# EAGLE schematic Tello_Power_PCB (EAGLE 9.6.2)

## Sheet 1 of 6
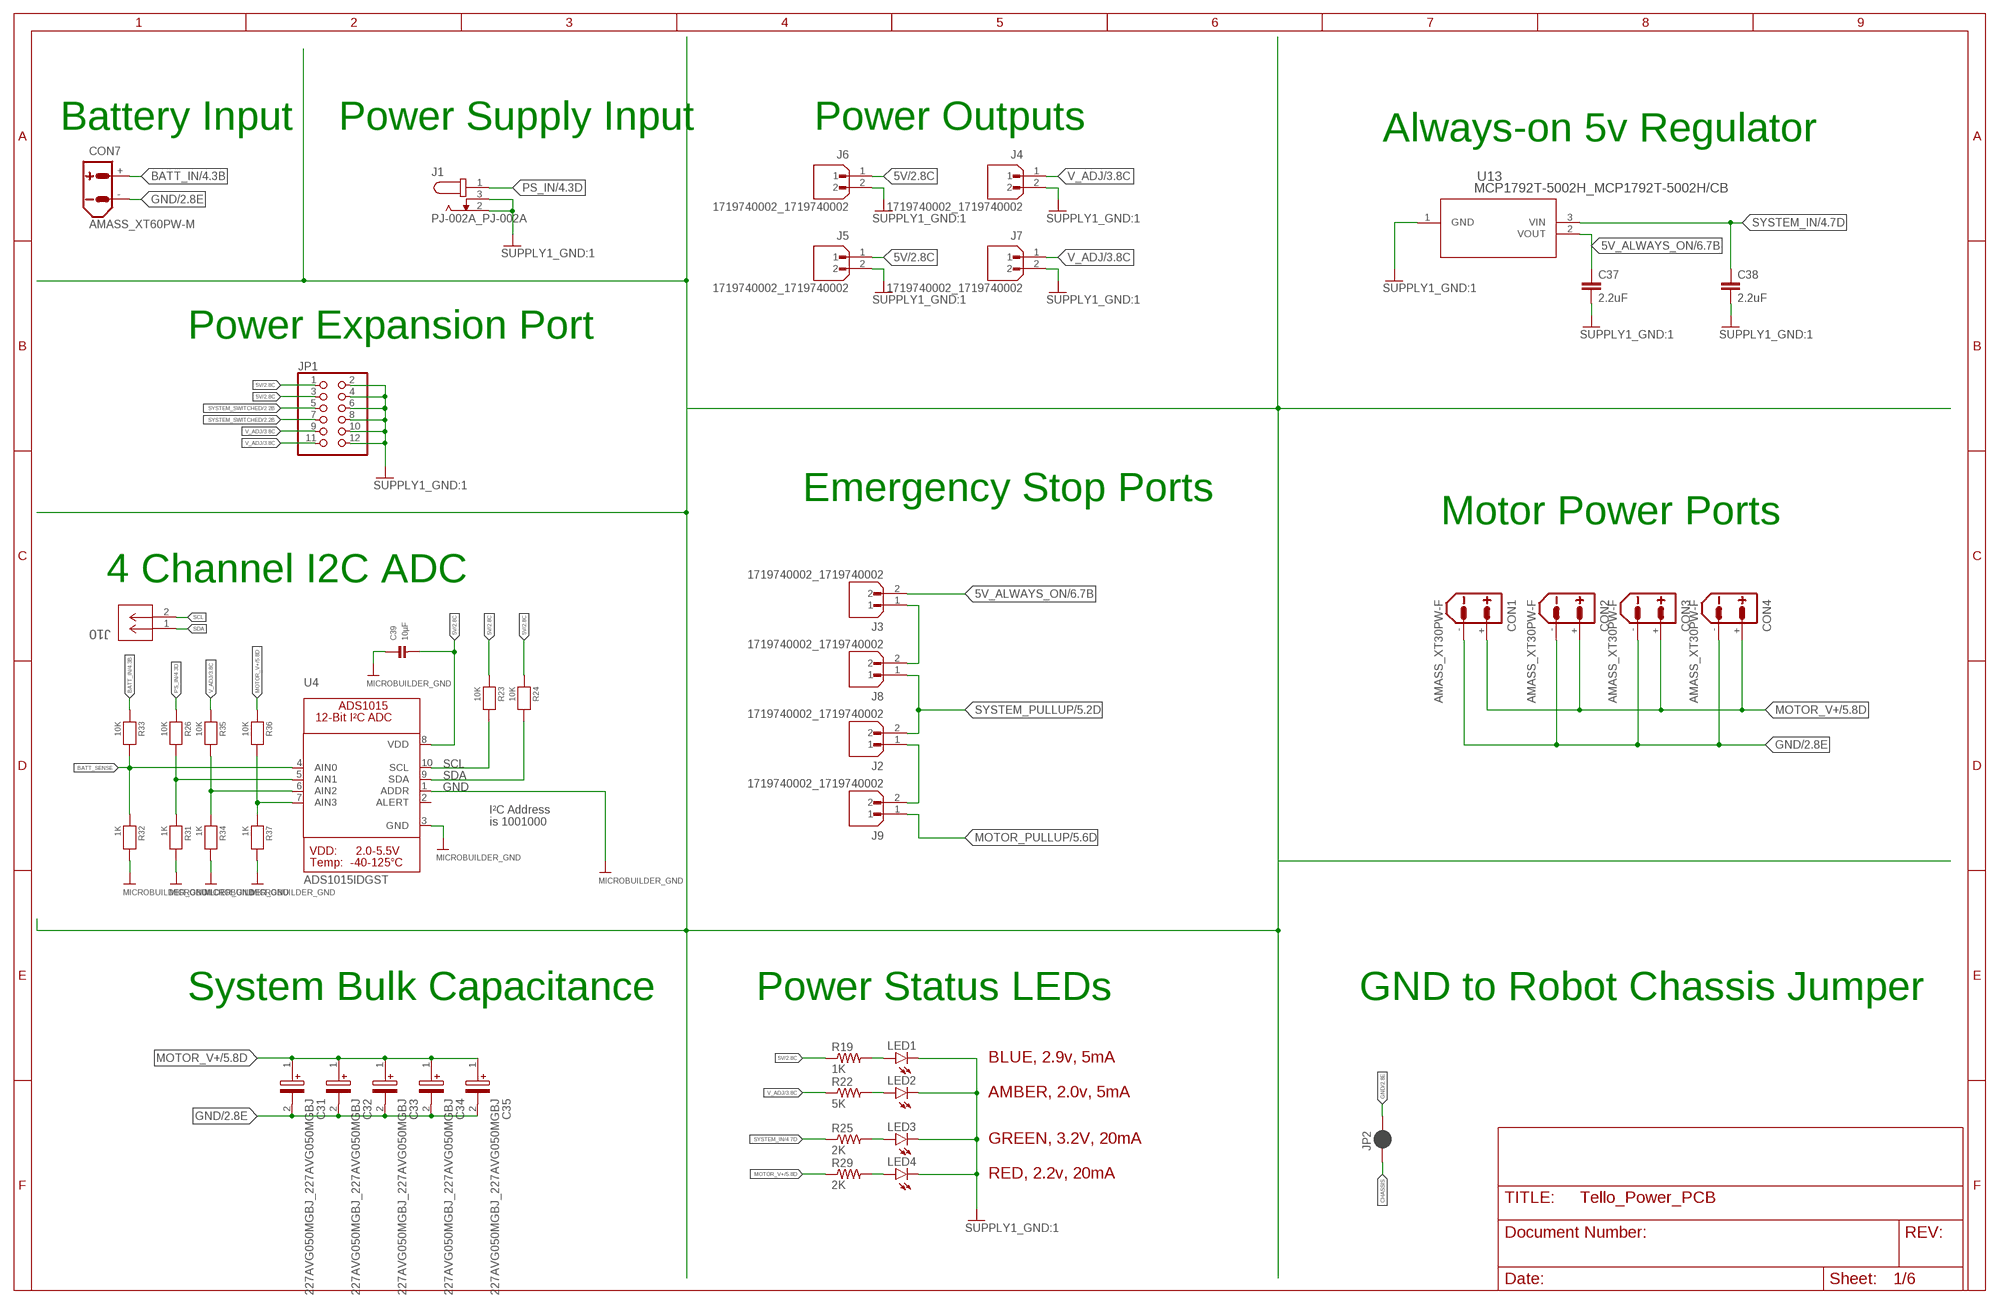
[diagram p0: schematic, sheet 1]

### Parts
C31  227AVG050MGBJ_227AVG050MGBJ  [227AVG050MGBJ_CAPPRD500W60D1025H1350]
C32  227AVG050MGBJ_227AVG050MGBJ  [227AVG050MGBJ_CAPPRD500W60D1025H1350]
C33  227AVG050MGBJ_227AVG050MGBJ  [227AVG050MGBJ_CAPPRD500W60D1025H1350]
C34  227AVG050MGBJ_227AVG050MGBJ  [227AVG050MGBJ_CAPPRD500W60D1025H1350]
C35  227AVG050MGBJ_227AVG050MGBJ  [227AVG050MGBJ_CAPPRD500W60D1025H1350]
C37  2.2uF  RCL_C-EUC0603  [RCL_C0603]
C38  2.2uF  RCL_C-EUC1206  [RCL_C1206]
C39  10µF  MICROBUILDER_CAP_CERAMIC0603  [MICROBUILDER_0603:1]
CON1  AMASS_XT30PW-F  [AMASS_XT30PW-F]
CON2  AMASS_XT30PW-F  [AMASS_XT30PW-F]
CON3  AMASS_XT30PW-F  [AMASS_XT30PW-F]
CON4  AMASS_XT30PW-F  [AMASS_XT30PW-F]
CON7  AMASS_XT60PW-M  [AMASS_XT60PW-M]
J1  PJ-002A_PJ-002A  [PJ-002A_CUI_PJ-002A]
J2  1719740002_1719740002  [1719740002_MOLEX_1719740002]
J3  1719740002_1719740002  [1719740002_MOLEX_1719740002]
J4  1719740002_1719740002  [1719740002_MOLEX_1719740002]
J5  1719740002_1719740002  [1719740002_MOLEX_1719740002]
J6  1719740002_1719740002  [1719740002_MOLEX_1719740002]
J7  1719740002_1719740002  [1719740002_MOLEX_1719740002]
J8  1719740002_1719740002  [1719740002_MOLEX_1719740002]
J9  1719740002_1719740002  [1719740002_MOLEX_1719740002]
J10  SM02B-GHS-TB_SM02BGHSTBLFSN  [SM02B-GHS-TB_CONN_SM02BGHSTB_JST]
JP1  PINHEAD_PINHD-2X6  [PINHEAD_2X06]
JP2  SPARKFUN-JUMPERS_JUMPER-SMT_2_NC_PASTE_NO-SILK  [SPARKFUN-JUMPERS_SMT-JUMPER_2_NC_PASTE_NO-SILK]
LED1  LED_LEDCHIP-LED0603  [LED_CHIP-LED0603]
LED2  LED_LEDCHIP-LED0603  [LED_CHIP-LED0603]
LED3  LED_LEDCHIP-LED0603  [LED_CHIP-LED0603]
LED4  LED_LEDCHIP-LED0603  [LED_CHIP-LED0603]
R19  1K  RCL_R-US_R0603  [RCL_R0603]
R22  5K  RCL_R-US_R0603  [RCL_R0603]
R23  10K  MICROBUILDER_RESISTOR0603  [MICROBUILDER_0603:1]
R24  10K  MICROBUILDER_RESISTOR0603  [MICROBUILDER_0603:1]
R25  2K  RCL_R-US_R0603  [RCL_R0603]
R26  10K  MICROBUILDER_RESISTOR0603  [MICROBUILDER_0603:1]
R29  2K  RCL_R-US_R0603  [RCL_R0603]
R31  1K  MICROBUILDER_RESISTOR0603  [MICROBUILDER_0603:1]
R32  1K  MICROBUILDER_RESISTOR0603  [MICROBUILDER_0603:1]
R33  10K  MICROBUILDER_RESISTOR0603  [MICROBUILDER_0603:1]
R34  1K  MICROBUILDER_RESISTOR0603  [MICROBUILDER_0603:1]
R35  10K  MICROBUILDER_RESISTOR0603  [MICROBUILDER_0603:1]
R36  10K  MICROBUILDER_RESISTOR0603  [MICROBUILDER_0603:1]
R37  1K  MICROBUILDER_RESISTOR0603  [MICROBUILDER_0603:1]
U4  ADS1015IDGST  MICROBUILDER_ADC_ADS1015  [MICROBUILDER_MSOP10]
U13  MCP1792T-5002H_MCP1792T-5002H/CB  [MCP1792T-5002H_SOT-23A_CB_MCH]

### Nets
5V: C39.2 J5.1 J6.1 JP1.1 JP1.3 R19.1 R23.1 R24.1 U4.8(VDD) ; also sheet 2
5V_ALWAYS_ON: C37.1 J3.2 U13.2(VOUT) ; also sheet 6
BATT_IN: CON7.+ R33.1 ; also sheet 4,5,6
BATT_SENSE: R32.1 R33.2 U4.4(AIN0)
CHASSIS: JP2.1
GND: C31.2(-) C32.2(-) C33.2(-) C34.2(-) C35.2(-) C37.2 C38.2 C39.1 CON1.- CON2.- CON3.- CON4.- CON7.- J1.2 J1.3 J4.2 J5.2 J6.2 J7.2 JP1.2 JP1.4 JP1.6 JP1.8 JP1.10 JP1.12 JP2.2 LED1.C LED2.C LED3.C LED4.C R31.2 R32.2 R34.2 R37.2 U4.1(ADDR) U4.3(GND) U13.1(GND) ; supply symbol labelled SUPPLY1_GND:1, MICROBUILDER_GND ; also sheet 2,3,4,5,6
MOTOR_PULLUP: J9.1 ; also sheet 5
MOTOR_V+: C31.1(+) C32.1(+) C33.1(+) C34.1(+) C35.1(+) CON1.+ CON2.+ CON3.+ CON4.+ R29.1 R36.1 ; also sheet 5
N$6: LED4.A R29.2
N$27: R26.2 R31.1 U4.5(AIN1)
N$28: J2.1 J9.2
N$29: R34.1 R35.2 U4.6(AIN2)
N$30: J3.1 J8.2
N$31: R36.2 R37.1 U4.7(AIN3)
N$32: LED3.A R25.2
N$33: LED2.A R22.2
N$34: LED1.A R19.2
PS_IN: J1.1 R26.1 ; also sheet 4
SCL: J10.2 R23.2 U4.10(SCL)
SDA: J10.1 R24.2 U4.9(SDA)
SYSTEM_IN: C38.1 R25.1 U13.3(VIN) ; also sheet 4,5,6
SYSTEM_PULLUP: J2.2 J8.1 ; also sheet 5
SYSTEM_SWITCHED: JP1.5 JP1.7 ; also sheet 2,3,5
V_ADJ: J4.1 J7.1 JP1.9 JP1.11 R22.1 R35.1 ; also sheet 3
Unconnected: U4.2(ALERT)

### Notes on the sheet
- Battery Input | Power Supply Input | Power Outputs | Always-on 5v Regulator
- Power Expansion Port
- Emergency Stop Ports
- Motor Power Ports
- 4 Channel I2C ADC
- I²C Address
  is 1001000
- System Bulk Capacitance | Power Status LEDs | GND to Robot Chassis Jumper
- BLUE, 2.9v, 5mA
- AMBER, 2.0v, 5mA
- GREEN, 3.2V, 20mA
- RED, 2.2v, 20mA

## Sheet 2 of 6
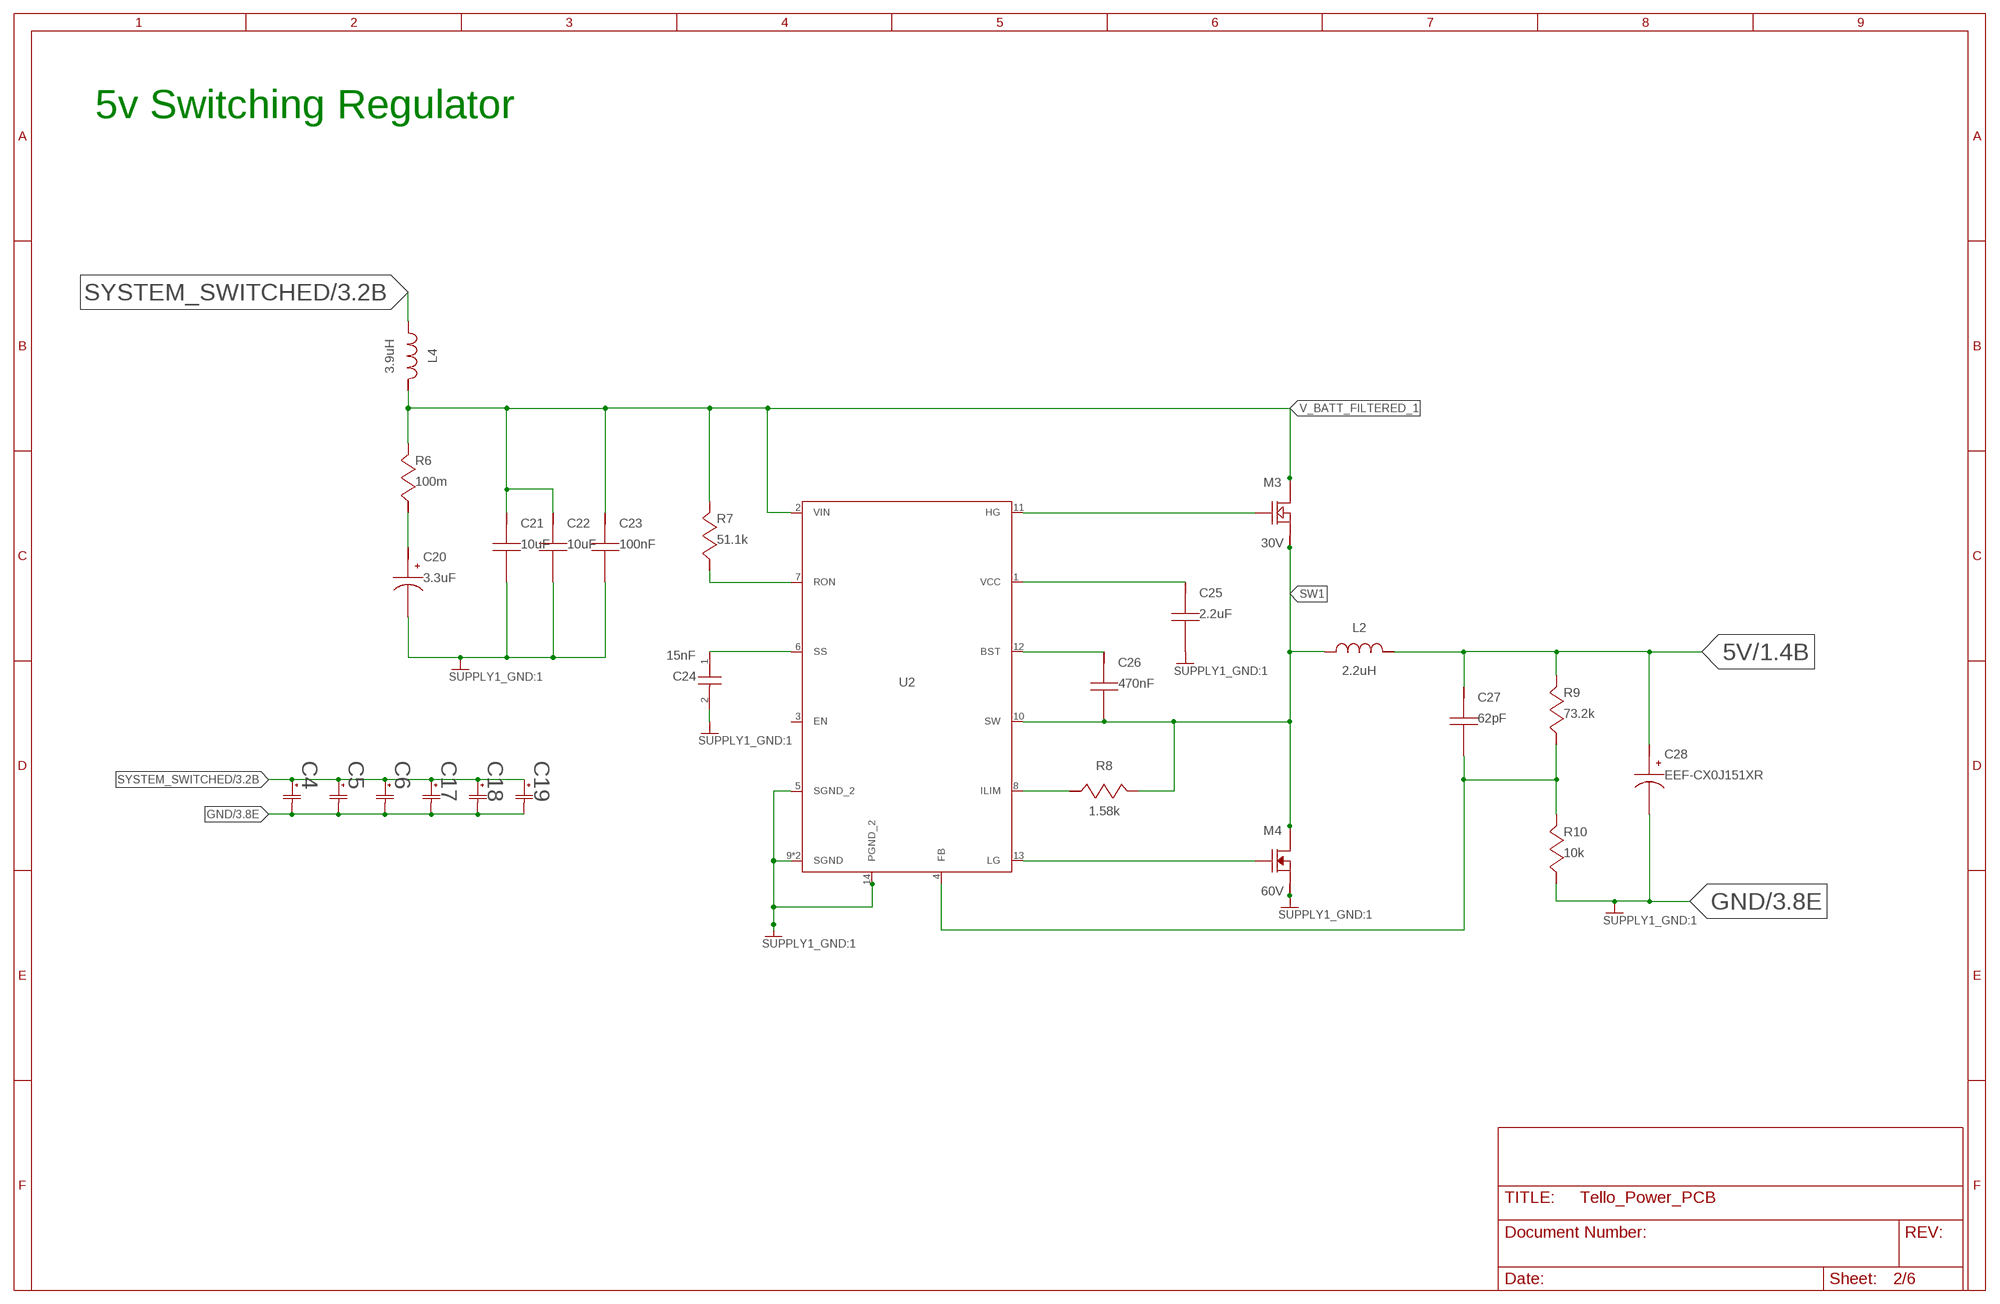
[diagram p1: schematic, sheet 2]

### Parts
C4  PCR1H820MCL1GS_PCR1H820MCL1GS  [PCR1H820MCL1GS_CAP_PC_10X8_NCH]
C5  PCR1H820MCL1GS_PCR1H820MCL1GS  [PCR1H820MCL1GS_CAP_PC_10X8_NCH]
C6  PCR1H820MCL1GS_PCR1H820MCL1GS  [PCR1H820MCL1GS_CAP_PC_10X8_NCH]
C17  PCR1H820MCL1GS_PCR1H820MCL1GS  [PCR1H820MCL1GS_CAP_PC_10X8_NCH]
C18  PCR1H820MCL1GS_PCR1H820MCL1GS  [PCR1H820MCL1GS_CAP_PC_10X8_NCH]
C19  PCR1H820MCL1GS_PCR1H820MCL1GS  [PCR1H820MCL1GS_CAP_PC_10X8_NCH]
C20  3.3uF  5V-LM3150MH_293D335X9035C2TE3  [5V-LM3150MH_6032-28]
C21  10uF  5V-LM3150MH_C2012X5R1V106K085AC  [5V-LM3150MH_0805]
C22  10uF  5V-LM3150MH_C2012X5R1V106K085AC  [5V-LM3150MH_0805]
C23  100nF  5V-LM3150MH_CGA3E2X7R1H104K080AA  [5V-LM3150MH_0603]
C24  15nF  CGA4F2C0G1H153J085AA_CGA4F2C0G1H153J085AA  [CGA4F2C0G1H153J085AA_CAPC2012X100N]
C25  2.2uF  5V-LM3150MH_EMK212BJ225KG-T  [5V-LM3150MH_0805]
C26  470nF  5V-LM3150MH_ECPU1C474MA5  [5V-LM3150MH_1206]
C27  62pF  5V-LM3150MH_CL21C620JBANNNC  [5V-LM3150MH_0805]
C28  EEF-CX0J151XR  5V-LM3150MH_CUSTOM_CAP  [5V-LM3150MH_C2917]
L2  2.2uH  5V-LM3150MH_XAL5030-222MEB  [5V-LM3150MH_XAL5030]
L4  3.9uH  5V-LM3150MH_NPI43C3R9MTRF  [5V-LM3150MH_IND_NPI43C]
M3  30V  5V-LM3150MH_CSD17579Q5A  [5V-LM3150MH_TRANS_NEXFET_Q5A]
M4  60V  5V-LM3150MH_CSD18537NQ5A  [5V-LM3150MH_TRANS_NEXFET_Q5A]
R6  100m  5V-LM3150MH_ERJ-3RSFR10V  [5V-LM3150MH_0603]
R7  51.1k  5V-LM3150MH_ERJ-6ENF5112V  [5V-LM3150MH_0805]
R8  1.58k  5V-LM3150MH_ERJ-6ENF1581V  [5V-LM3150MH_0805]
R9  73.2k  5V-LM3150MH_CRCW080573K2FKEA  [5V-LM3150MH_0805]
R10  10k  5V-LM3150MH_CRCW080510K0FKEA  [5V-LM3150MH_0805]
U2  5V-LM3150MH_LM3150MH/NOPB  [5V-LM3150MH_MXA14A]

### Nets
5V: C27.1 C28.P$1(+) L2.2 R9.1 ; also sheet 1
GND: C4.2 C5.2 C6.2 C17.2 C18.2 C19.2 C20.2(-) C21.2 C22.2 C23.2 C24.2 C25.2 C28.P$2(-) M4.1(SOURCE) M4.2(SOURCE) M4.3(SOURCE) R10.2 U2.5(SGND_2) U2.9(SGND) U2.14(PGND_2) U2.15(SGND) ; supply symbol labelled SUPPLY1_GND:1 ; also sheet 1,3,4,5,6
N$2: R7.2 U2.7(RON)
N$5: C24.1 U2.6(SS)
N$7: C20.1(+) R6.2
N$10: R8.2 U2.8(ILIM)
N$11: C26.1 U2.12(BST)
N$12: C25.1 U2.1(VCC)
N$13: M3.4(GATE) U2.11(HG)
N$14: M4.4(GATE) U2.13(LG)
N$18: C27.2 R9.2 R10.1 U2.4(FB)
SW1: C26.2 L2.1 M3.1(SOURCE) M3.2(SOURCE) M3.3(SOURCE) M4.5(DRAIN) M4.6(DRAIN) M4.7(DRAIN) M4.8(DRAIN) M4.9(DRAIN) R8.1 U2.10(SW)
SYSTEM_SWITCHED: C4.1 C5.1 C6.1 C17.1 C18.1 C19.1 L4.1 ; also sheet 1,3,5
V_BATT_FILTERED_1: C21.1 C22.1 C23.1 L4.2 M3.5(DRAIN) M3.6(DRAIN) M3.7(DRAIN) M3.8(DRAIN) M3.9(DRAIN) R6.1 R7.1 U2.2(VIN)
Unconnected: U2.3(EN)

### Notes on the sheet
- 5v Switching Regulator

## Sheet 3 of 6
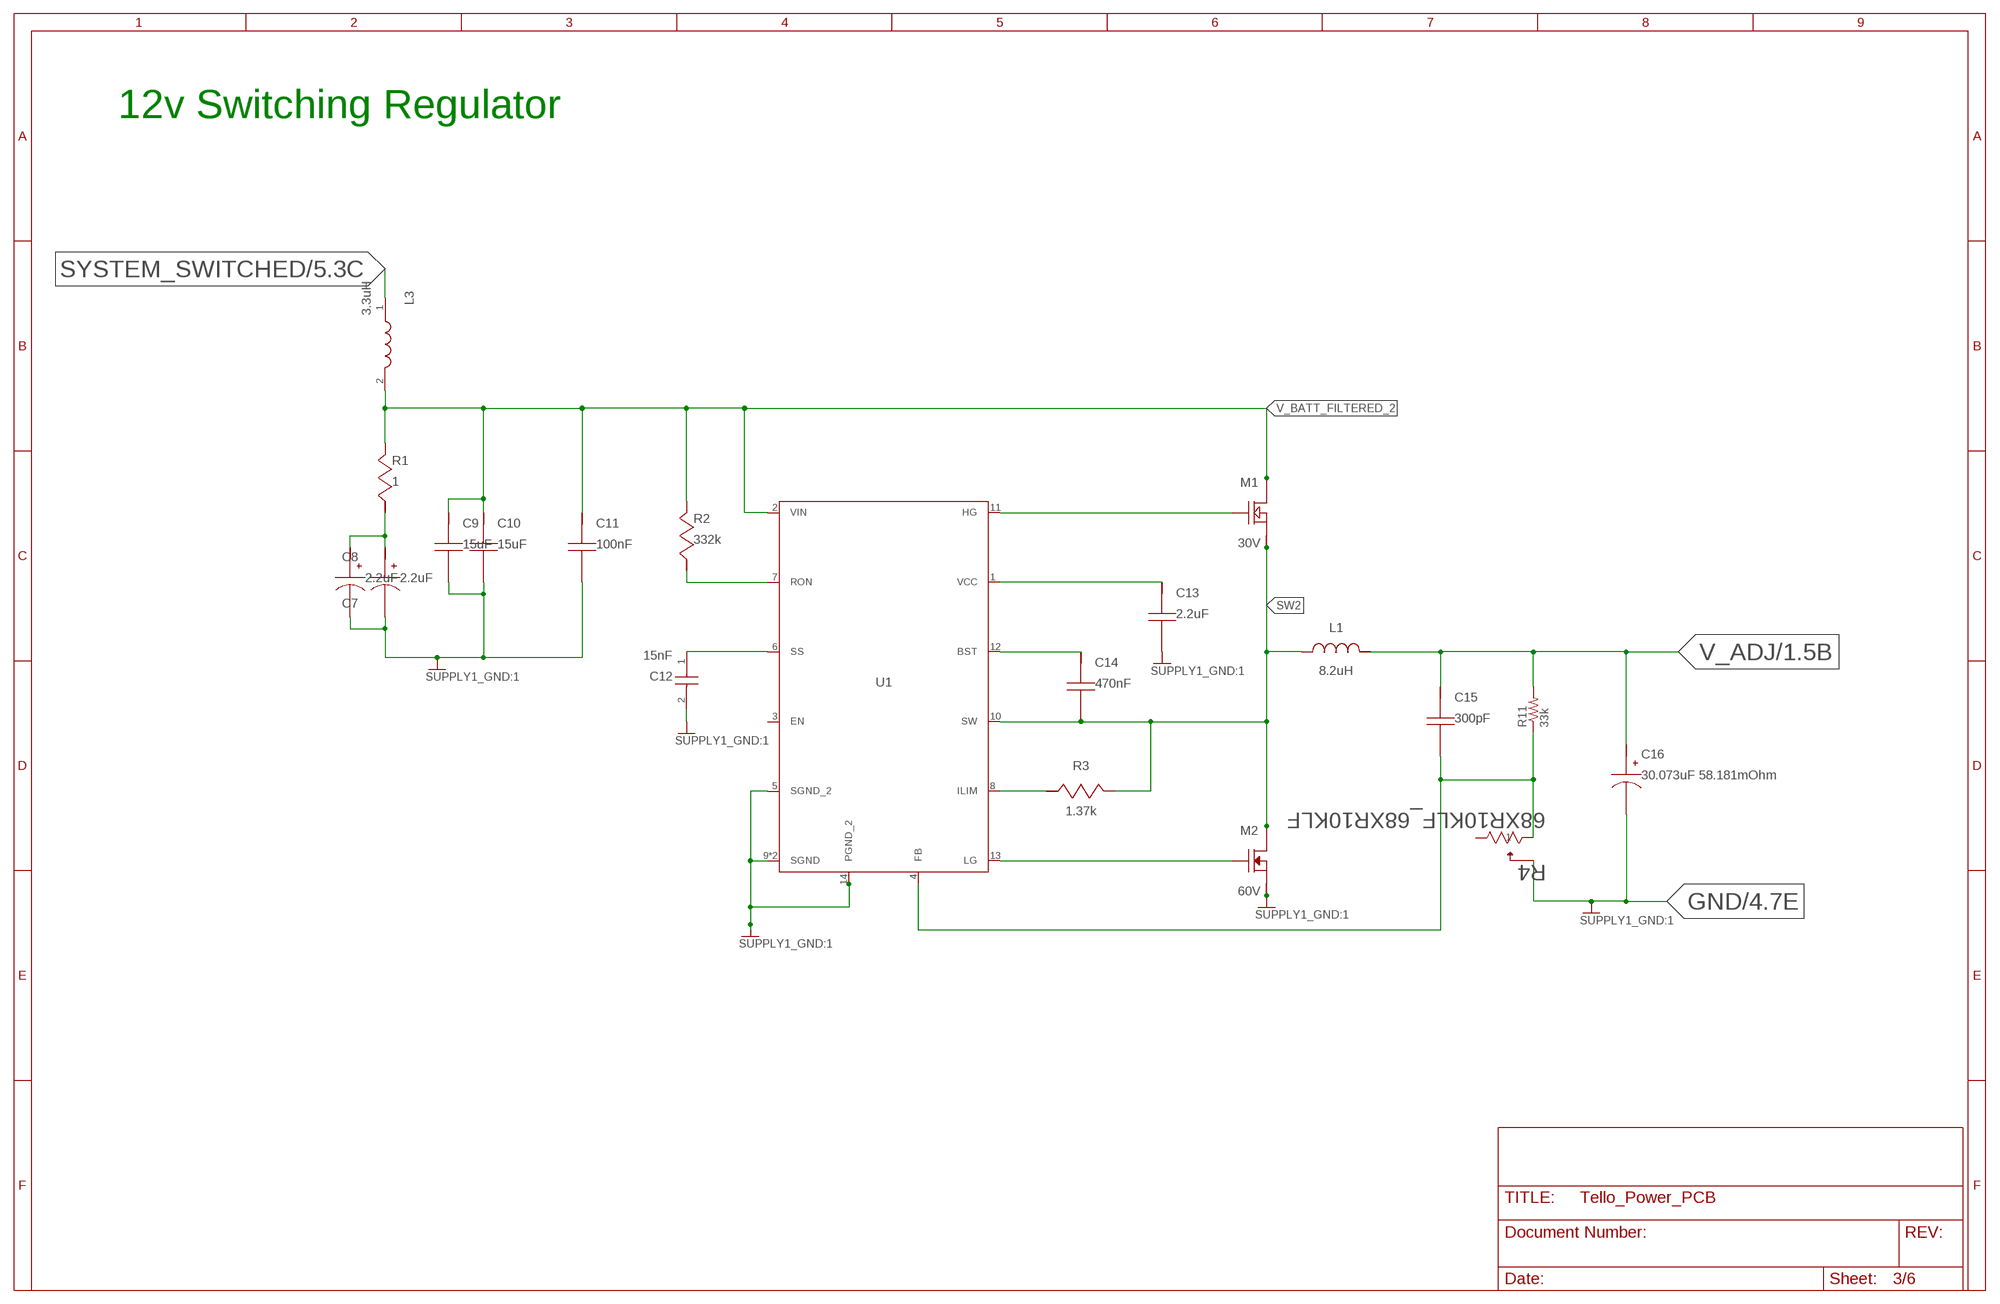
[diagram p2: schematic, sheet 3]

### Parts
C7  2.2uF  12V--LM3150_TPSB475K035R0700  [12V--LM3150_3528-21]
C8  2.2uF  12V--LM3150_TPSB475K035R0700  [12V--LM3150_3528-21]
C9  15uF  12V--LM3150_C2012X5R1V156M125AC  [12V--LM3150_0805:1]
C10  15uF  12V--LM3150_C2012X5R1V156M125AC  [12V--LM3150_0805:1]
C11  100nF  12V--LM3150_C1005X5R1H104K050BB  [12V--LM3150_0402]
C12  15nF  CGA4F2C0G1H153J085AA_CGA4F2C0G1H153J085AA  [CGA4F2C0G1H153J085AA_CAPC2012X100N]
C13  2.2uF  12V--LM3150_EMK212BJ225KG-T:1  [12V--LM3150_0805:1]
C14  470nF  12V--LM3150_ECPU1C474MA5:1  [12V--LM3150_1206:1]
C15  300pF  12V--LM3150_C0805C301J5GACTU  [12V--LM3150_0805:1]
C16  30.073uF 58.181mOhm  12V--LM3150_PCV1E330MCL1GS  [12V--LM3150_PCV1E330MCL1GS]
L1  8.2uH  12V--LM3150_74437358082  [12V--LM3150_WE-LHMI_8040]
L3  3.3uH  XAL4030-332MEB_XAL4030-332MEB  [XAL4030-332MEB_XAL4030-332MEB]
M1  30V  12V--LM3150_CSD17579Q5A:1  [12V--LM3150_TRANS_NEXFET_Q5A:1]
M2  60V  12V--LM3150_CSD18537NQ5A:1  [12V--LM3150_TRANS_NEXFET_Q5A:1]
R1  1  12V--LM3150_CRCW04021R00FKED  [12V--LM3150_0402]
R2  332k  12V--LM3150_ERJ-6ENF3323V  [12V--LM3150_0805:1]
R3  1.37k  12V--LM3150_ERJ-6ENF1371V  [12V--LM3150_0805:1]
R4  68XR10KLF_68XR10KLF  [68XR10KLF_RES3_68X_TTE]
R11  33k  RCL_R-US_R0805  [RCL_R0805]
U1  5V-LM3150MH_LM3150MH/NOPB  [5V-LM3150MH_MXA14A]

### Nets
GND: C7.2(-) C8.2(-) C9.2 C10.2 C11.2 C12.2 C13.2 C16.P$3(-) M2.1(SOURCE) M2.2(SOURCE) M2.3(SOURCE) R4.2 U1.5(SGND_2) U1.9(SGND) U1.14(PGND_2) U1.15(SGND) ; supply symbol labelled SUPPLY1_GND:1 ; also sheet 1,2,4,5,6
N$17: C7.1(+) C8.1(+) R1.2
N$19: R2.2 U1.7(RON)
N$20: C12.1 U1.6(SS)
N$21: R3.2 U1.8(ILIM)
N$22: C14.1 U1.12(BST)
N$23: C13.1 U1.1(VCC)
N$24: M1.4(GATE) U1.11(HG)
N$25: M2.4(GATE) U1.13(LG)
N$26: C15.2 R4.3 R11.1 U1.4(FB)
SW2: C14.2 L1.1 M1.1(SOURCE) M1.2(SOURCE) M1.3(SOURCE) M2.5(DRAIN) M2.6(DRAIN) M2.7(DRAIN) M2.8(DRAIN) M2.9(DRAIN) R3.1 U1.10(SW)
SYSTEM_SWITCHED: L3.1 ; also sheet 1,2,5
V_ADJ: C15.1 C16.P$1(+) L1.2 R11.2 ; also sheet 1
V_BATT_FILTERED_2: C9.1 C10.1 C11.1 L3.2 M1.5(DRAIN) M1.6(DRAIN) M1.7(DRAIN) M1.8(DRAIN) M1.9(DRAIN) R1.1 R2.1 U1.2(VIN)
Unconnected: R4.1 U1.3(EN)

### Notes on the sheet
- 12v Switching Regulator

## Sheet 4 of 6
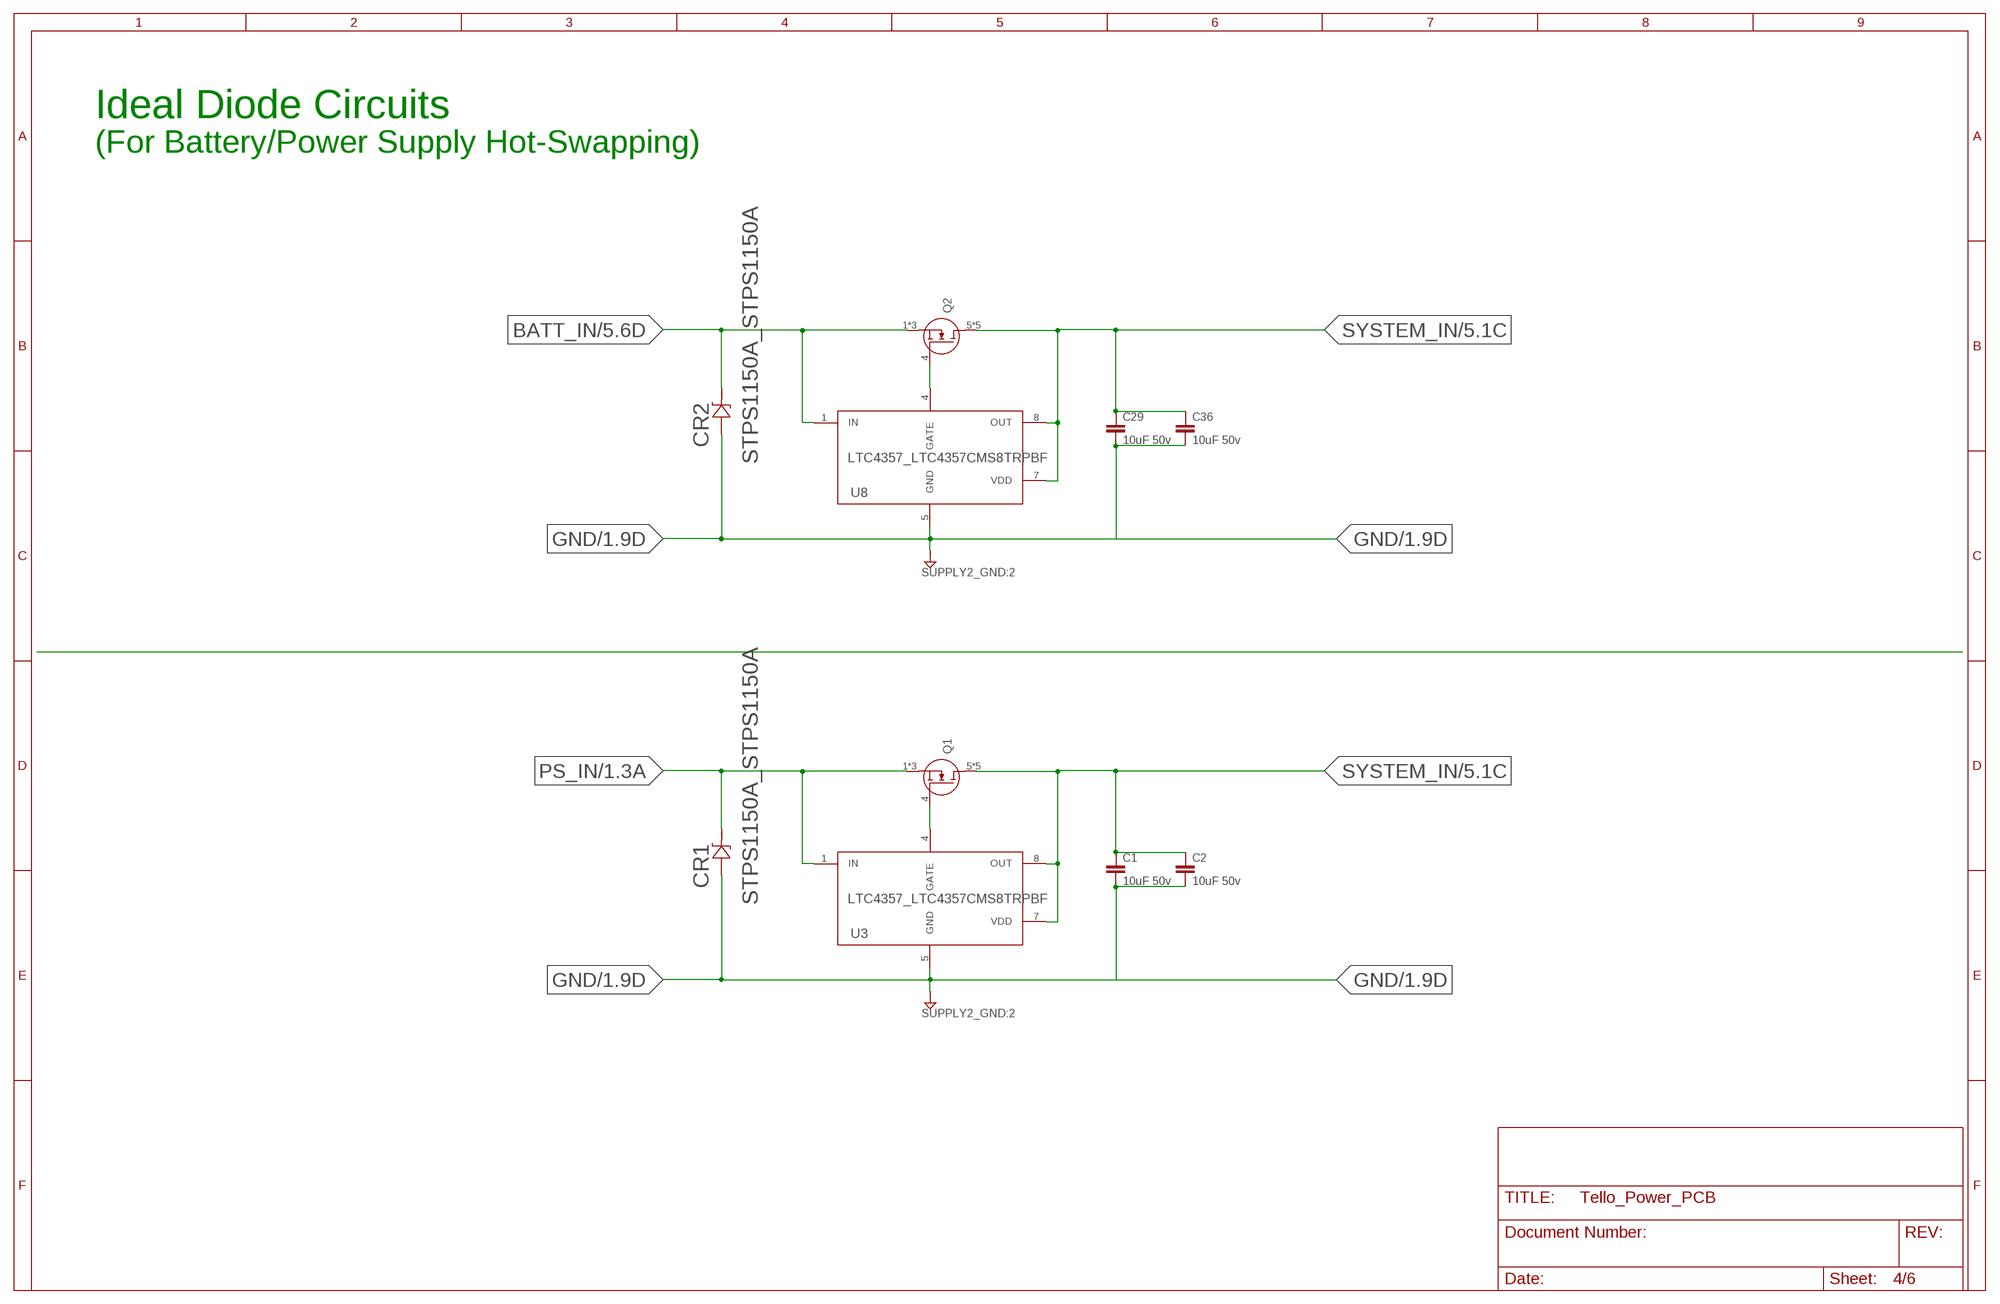
[diagram p3: schematic, sheet 4]

### Parts
C1  10uF 50v  RCL_C-EUC1206  [RCL_C1206]
C2  10uF 50v  RCL_C-EUC1206  [RCL_C1206]
C29  10uF 50v  RCL_C-EUC1206  [RCL_C1206]
C36  10uF 50v  RCL_C-EUC1206  [RCL_C1206]
CR1  STPS1150A_STPS1150A  [STPS1150A_SMA_STM]
CR2  STPS1150A_STPS1150A  [STPS1150A_SMA_STM]
Q1  BSC027N06LS5ATMA1_BSC027N06LS5ATMA1  [BSC027N06LS5ATMA1_BSC027N06LS5ATMA1]
Q2  BSC027N06LS5ATMA1_BSC027N06LS5ATMA1  [BSC027N06LS5ATMA1_BSC027N06LS5ATMA1]
U3  LTC4357_LTC4357CMS8TRPBF  [LTC4357_MSOP-8_MS_LIT]
U8  LTC4357_LTC4357CMS8TRPBF  [LTC4357_MSOP-8_MS_LIT]

### Nets
BATT_IN: CR2.1 Q2.1(S) Q2.2(S) Q2.3(S) U8.1(IN) ; also sheet 1,5,6
GND: C1.2 C2.2 C29.2 C36.2 CR1.2 CR2.2 U3.5(GND) U8.5(GND) ; supply symbol labelled SUPPLY2_GND:2 ; also sheet 1,2,3,5,6
N$4: Q1.4(G) U3.4(GATE)
N$16: Q2.4(G) U8.4(GATE)
PS_IN: CR1.1 Q1.1(S) Q1.2(S) Q1.3(S) U3.1(IN) ; also sheet 1
SYSTEM_IN: C1.1 C2.1 C29.1 C36.1 Q1.5(D) Q1.6(D) Q1.7(D) Q1.8(D) Q1.9(D) Q2.5(D) Q2.6(D) Q2.7(D) Q2.8(D) Q2.9(D) U3.7(VDD) U3.8(OUT) U8.7(VDD) U8.8(OUT) ; also sheet 1,5,6

### Notes on the sheet
- Ideal Diode Circuits
- (For Battery/Power Supply Hot-Swapping)

## Sheet 5 of 6
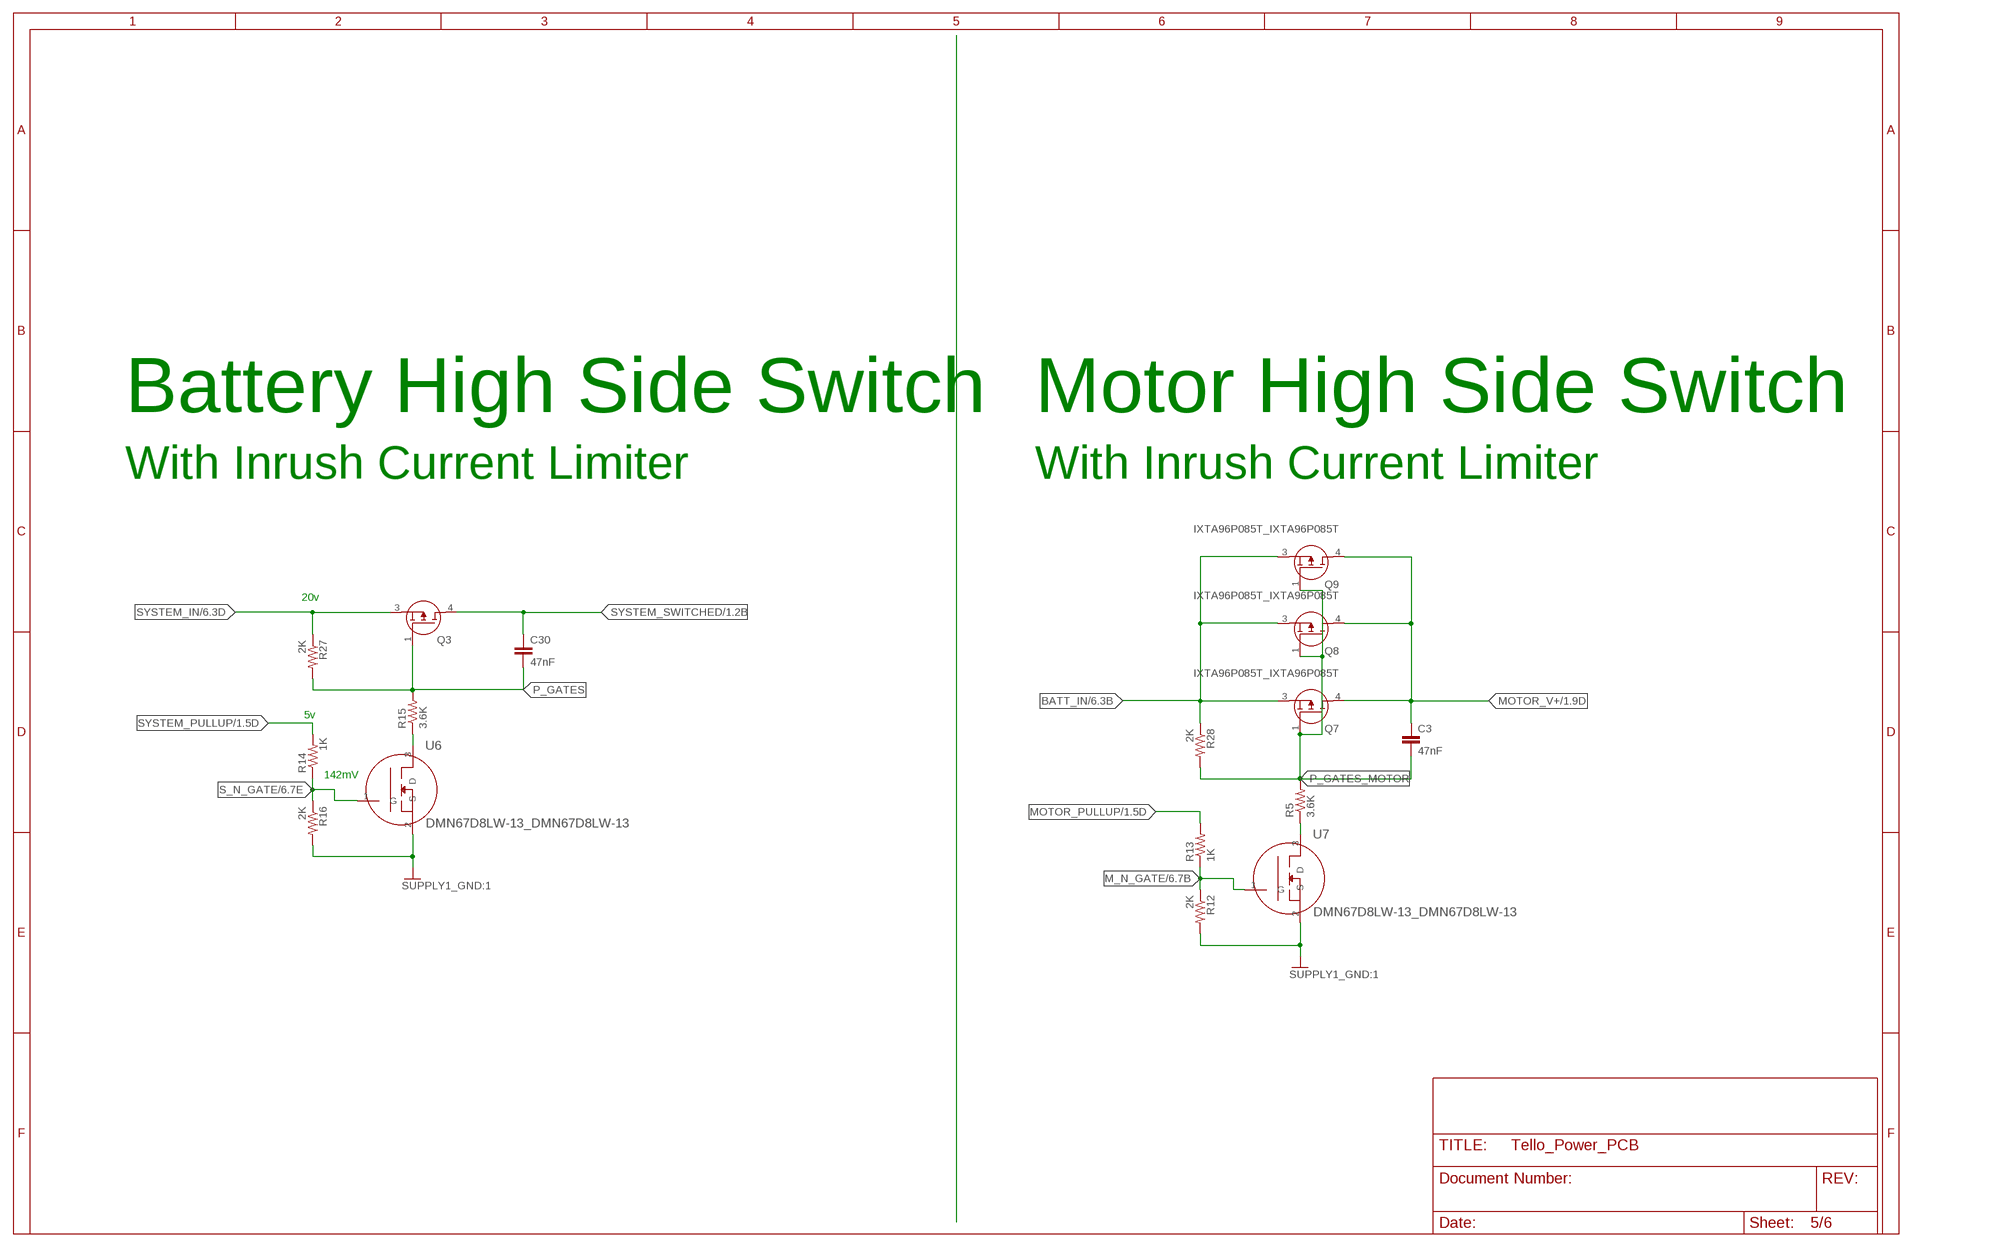
[diagram p4: schematic, sheet 5]

### Parts
C3  47nF  RCL_C-EUC0603  [RCL_C0603]
C30  47nF  RCL_C-EUC0603  [RCL_C0603]
Q3  IXTA96P085T_IXTA96P085T  [IXTA96P085T_IXTA96P085T]
Q7  IXTA96P085T_IXTA96P085T  [IXTA96P085T_IXTA96P085T]
Q8  IXTA96P085T_IXTA96P085T  [IXTA96P085T_IXTA96P085T]
Q9  IXTA96P085T_IXTA96P085T  [IXTA96P085T_IXTA96P085T]
R5  3.6K  RCL_R-US_R0603  [RCL_R0603]
R12  2K  RCL_R-US_R0603  [RCL_R0603]
R13  1K  RCL_R-US_R0603  [RCL_R0603]
R14  1K  RCL_R-US_R0603  [RCL_R0603]
R15  3.6K  RCL_R-US_R0603  [RCL_R0603]
R16  2K  RCL_R-US_R0603  [RCL_R0603]
R27  2K  RCL_R-US_R0603  [RCL_R0603]
R28  2K  RCL_R-US_R0603  [RCL_R0603]
U6  DMN67D8LW-13_DMN67D8LW-13  [DMN67D8LW-13_DMN67D8LW-13_DIO]
U7  DMN67D8LW-13_DMN67D8LW-13  [DMN67D8LW-13_DMN67D8LW-13_DIO]

### Nets
BATT_IN: Q7.3(S) Q8.3(S) Q9.3(S) R28.1 ; also sheet 1,4,6
GND: R12.2 R16.2 U6.2(S) U7.2(S) ; supply symbol labelled SUPPLY1_GND:1 ; also sheet 1,2,3,4,6
M_N_GATE: R12.1 R13.1 U7.1(G) ; also sheet 6
MOTOR_PULLUP: R13.2 ; also sheet 1
MOTOR_V+: C3.1 Q7.4(D) Q8.4(D) Q9.4(D) ; also sheet 1
N$1: R5.1 U7.3(D)
N$15: R15.1 U6.3(D)
P_GATES: C30.2 Q3.1(G) R15.2 R27.2
P_GATES_MOTOR: C3.2 Q7.1(G) Q8.1(G) Q9.1(G) R5.2 R28.2
S_N_GATE: R14.1 R16.1 U6.1(G) ; also sheet 6
SYSTEM_IN: Q3.3(S) R27.1 ; also sheet 1,4,6
SYSTEM_PULLUP: R14.2 ; also sheet 1
SYSTEM_SWITCHED: C30.1 Q3.4(D) ; also sheet 1,2,3

### Notes on the sheet
- Battery High Side Switch | Motor High Side Switch
- With Inrush Current Limiter | With Inrush Current Limiter
- 20v
- 5v
- 142mV

## Sheet 6 of 6
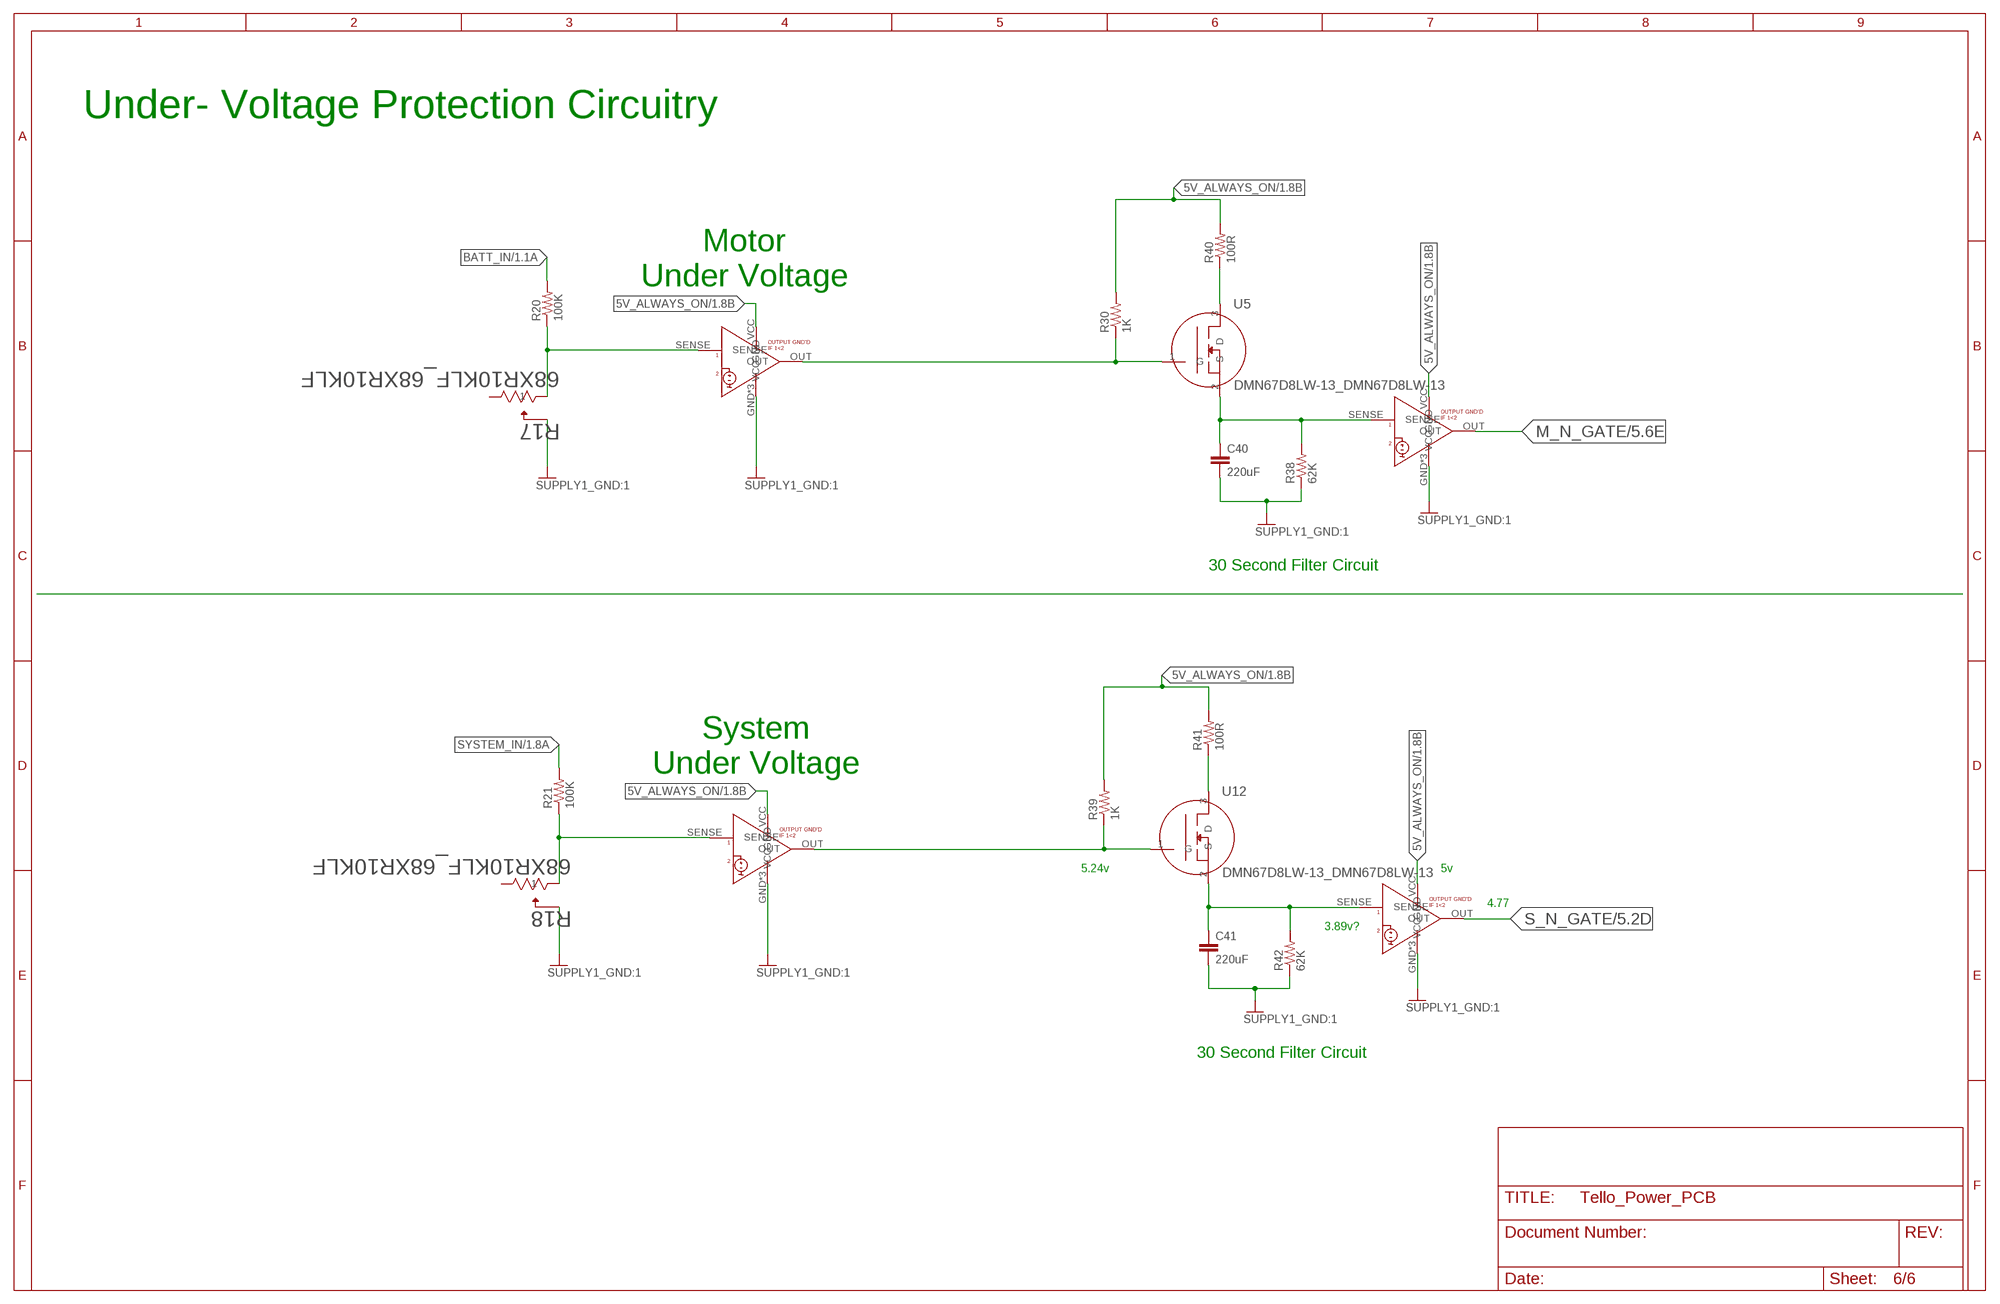
[diagram p5: schematic, sheet 6]

### Parts
C40  220uF  RCL_C-EUC1210  [RCL_C1210]
C41  220uF  RCL_C-EUC1210  [RCL_C1210]
R17  68XR10KLF_68XR10KLF  [68XR10KLF_RES3_68X_TTE]
R18  68XR10KLF_68XR10KLF  [68XR10KLF_RES3_68X_TTE]
R20  100K  RCL_R-US_R0603  [RCL_R0603]
R21  100K  RCL_R-US_R0603  [RCL_R0603]
R30  1K  RCL_R-US_R0603  [RCL_R0603]
R38  62K  RCL_R-US_R0603  [RCL_R0603]
R39  1K  RCL_R-US_R0603  [RCL_R0603]
R40  100R  RCL_R-US_R0603  [RCL_R0603]
R41  100R  RCL_R-US_R0603  [RCL_R0603]
R42  62K  RCL_R-US_R0603  [RCL_R0603]
U5  DMN67D8LW-13_DMN67D8LW-13  [DMN67D8LW-13_DMN67D8LW-13_DIO]
U9  TLV6713DDC_TLV6713DDCTDDC0006A_M  [TLV6713DDC_DDC0006A_M]
U10  TLV6713DDC_TLV6713DDCTDDC0006A_M  [TLV6713DDC_DDC0006A_M]
U11  TLV6713DDC_TLV6713DDCTDDC0006A_M  [TLV6713DDC_DDC0006A_M]
U12  DMN67D8LW-13_DMN67D8LW-13  [DMN67D8LW-13_DMN67D8LW-13_DIO]
U14  TLV6713DDC_TLV6713DDCTDDC0006A_M  [TLV6713DDC_DDC0006A_M]

### Nets
5V_ALWAYS_ON: R30.2 R39.2 R40.2 R41.2 U9.VCC U10.VCC U11.VCC U14.VCC ; also sheet 1
BATT_IN: R20.2 ; also sheet 1,4,5
GND: C40.2 C41.2 R17.2 R18.2 R38.1 R42.1 U9.GND U9.GND@1(GND) U9.GND@2(GND) U10.GND U10.GND@1(GND) U10.GND@2(GND) U11.GND U11.GND@1(GND) U11.GND@2(GND) U14.GND U14.GND@1(GND) U14.GND@2(GND) ; supply symbol labelled SUPPLY1_GND:1 ; also sheet 1,2,3,4,5
M_N_GATE: U11.OUT ; also sheet 5
N$3: R30.1 U5.1(G) U10.OUT
N$8: R18.3 R21.1 U9.SENSE
N$9: R17.3 R20.1 U10.SENSE
N$35: C40.1 R38.2 U5.2(S) U11.SENSE
N$36: R40.1 U5.3(D)
N$37: R39.1 U9.OUT U12.1(G)
N$38: R41.1 U12.3(D)
N$39: C41.1 R42.2 U12.2(S) U14.SENSE
S_N_GATE: U14.OUT ; also sheet 5
SYSTEM_IN: R21.2 ; also sheet 1,4,5
Unconnected: R17.1 R18.1

### Notes on the sheet
- Under- Voltage Protection Circuitry
- Motor
  Under Voltage
- 30 Second Filter Circuit
- System
  Under Voltage
- 5.24v | 5v
- 4.77
- 3.89v?
- 30 Second Filter Circuit

## Library data of the parts
C1-C3 C29 C30 C36-C38 C40 C41 = Tello_Power_PCB:RCL_C-EU: CAPACITOR, European symbol; SPICEPREFIX: C
C4-C6 C17-C19 = Tello_Power_PCB:PCR1H820MCL1GS_PCR1H820MCL1GS; COPYRIGHT: Copyright (C) 2022 Ultra Librarian. All rights reserved.; DIGI-KEY_PART_NUMBER_1: 493-13771-1-ND; DIGI-KEY_PART_NUMBER_2: 493-13771-2-ND; DIGI-KEY_PART_NUMBER_3: 493-13771-6-ND; MANUFACTURER_PART_NUMBER: PCR1H820MCL1GS; MFR_NAME: Nichicon
C7 C8 = Tello_Power_PCB:12V--LM3150_TPSB475K035R0700; CAP: 4.7E6; ESR: 0.7; IRMS: 0.314; MANUFACTURER_NAME: AVX; MANUFACTURER_PART_NUMBER: TPSB475K035R0700; VDC: 35.0; VENDOR: AVX
C9 C10 = Tello_Power_PCB:12V--LM3150_C2012X5R1V156M125AC; CAP: 1.5E5; DATASHEETURL: httpsproduct.tdk.cominfoencatalogdatasheetsmlcc%5Fcommercial%5Fgeneral%5Fen.pdf; ESR: 0.001669; IRMS: 5.04984; MANUFACTURER_NAME: TDK; MANUFACTURER_PART_NUMBER: C2012X5R1V156M125AC; VDC: 35.0; VENDOR: TDK
C11 = Tello_Power_PCB:12V--LM3150_C1005X5R1H104K050BB; CAP: 1.0E7; DATASHEETURL: httpsproduct.tdk.comensearchcapacitorceramicmlccinfo?part%5Fno%3DC1005X5R1H104K050BB; ESR: 0.039064; IRMS: 0.814669; MANUFACTURER_NAME: TDK; MANUFACTURER_PART_NUMBER: C1005X5R1H104K050BB; VDC: 50.0; VENDOR: TDK
C12 C24 = Tello_Power_PCB:CGA4F2C0G1H153J085AA_CGA4F2C0G1H153J085AA: Capacitor Auto CGA 0805 50V 15nF C0G Source: Datasheet <http://docs-emea.rs-online.com/webdocs/14e9/0900766b814e9125.pdf>; DESCRIPTION: Capacitor Auto CGA 0805 50V 15nF C0G; HEIGHT: 1mm; MANUFACTURER_NAME: TDK; MANUFACTURER_PART_NUMBER: CGA4F2C0G1H153J085AA; MOUSER_PART_NUMBER: 810-CGA4F2C0G1H153J; MOUSER_PRICE-STOCK: https://www.mouser.com/Search/Refine.aspx?Keyword=810-CGA4F2C0G1H153J; RS_PART_NUMBER: 9155168; RS_PRICE-STOCK: https://uk.rs-online.com/web/p/products/9155168
C13 = Tello_Power_PCB:12V--LM3150_EMK212BJ225KG-T*?:1; CAP: 2.2E6; ESR: 0.0; IRMS: 0.0; MANUFACTURER_NAME: Taiyo Yuden; MANUFACTURER_PART_NUMBER: EMK212BJ225KGT; VDC: 16.0; VENDOR: Taiyo Yuden
C14 = Tello_Power_PCB:12V--LM3150_ECPU1C474MA5*?:1; CAP: 4.7E7; DATASHEETURL: httpwww.panasonic.comindustrialcomponentspdfef038%5Fecpu%5Fdne.pdf; ESR: 0.0; IRMS: 0.0; MANUFACTURER_NAME: Panasonic; MANUFACTURER_PART_NUMBER: ECPU1C474MA5; VDC: 16.0; VENDOR: Panasonic
C15 = Tello_Power_PCB:12V--LM3150_C0805C301J5GACTU; CAP: 3.0E10; DATASHEETURL: httpwww.kemet.comdocfinder?Partnumber%3DC0805C301J5GACTU; ESR: 0.0; IRMS: 0.0; MANUFACTURER_NAME: Kemet; MANUFACTURER_PART_NUMBER: C0805C301J5GACTU; VDC: 50.0; VENDOR: Kemet
C16 = Tello_Power_PCB:12V--LM3150_PCV1E330MCL1GS
C20 = Tello_Power_PCB:5V-LM3150MH_293D335X9035C2TE3; CAP: 3.3E6; ESR: 2.1; IRMS: 0.23; MANUFACTURER_NAME: VishaySprague; MANUFACTURER_PART_NUMBER: 293D335X9035C2TE3; VDC: 35.0; VENDOR: VishaySprague
C21 C22 = Tello_Power_PCB:5V-LM3150MH_C2012X5R1V106K085AC; CAP: 1.0E5; DATASHEETURL: httpsproduct.tdk.comensearchcapacitorceramicmlccinfo?part%5Fno%3DC2012X5R1V106K085AC; ESR: 0.002818; IRMS: 3.88676; MANUFACTURER_NAME: TDK; MANUFACTURER_PART_NUMBER: C2012X5R1V106K085AC; VDC: 35.0; VENDOR: TDK
C23 = Tello_Power_PCB:5V-LM3150MH_CGA3E2X7R1H104K080AA; CAP: 1.0E7; DATASHEETURL: httpsproduct.tdk.comensearchcapacitorceramicmlccinfo?part%5Fno%3DCGA3E2X7R1H104K080AA; ESR: 0.0296; IRMS: 0.97199; MANUFACTURER_NAME: TDK; MANUFACTURER_PART_NUMBER: CGA3E2X7R1H104K080AA; VDC: 50.0; VENDOR: TDK
C25 = Tello_Power_PCB:5V-LM3150MH_EMK212BJ225KG-T; CAP: 2.2E6; ESR: 0.0; IRMS: 0.0; MANUFACTURER_NAME: Taiyo Yuden; MANUFACTURER_PART_NUMBER: EMK212BJ225KGT; VDC: 16.0; VENDOR: Taiyo Yuden
C26 = Tello_Power_PCB:5V-LM3150MH_ECPU1C474MA5; CAP: 4.7E7; DATASHEETURL: httpwww.panasonic.comindustrialcomponentspdfef038%5Fecpu%5Fdne.pdf; ESR: 0.0; IRMS: 0.0; MANUFACTURER_NAME: Panasonic; MANUFACTURER_PART_NUMBER: ECPU1C474MA5; VDC: 16.0; VENDOR: Panasonic
C27 = Tello_Power_PCB:5V-LM3150MH_CL21C620JBANNNC; CAP: 6.2E11; DATASHEETURL: httpwww.samsungsem.comservletFileDownload?type%3Dspec%26file%3DCL21C620JBANNNC.pdf; ESR: 0.0; IRMS: 0.0; MANUFACTURER_NAME: Samsung ElectroMechanics; MANUFACTURER_PART_NUMBER: CL21C620JBANNNC; VDC: 50.0; VENDOR: Samsung ElectroMechanics
C28 = Tello_Power_PCB:5V-LM3150MH_CUSTOM_CAP
C31-C35 = Tello_Power_PCB:227AVG050MGBJ_227AVG050MGBJ: Aluminum Organic Polymer Capacitors 220uF 50V 20% POLYMER/IC Source: Datasheet <http://www.illinoiscapacitor.com/pdf/seriesDocuments/AVG series.pdf>; ARROW_PART_NUMBER: 227AVG050MGBJ; ARROW_PRICE-STOCK: https://www.arrow.com/en/products/227avg050mgbj/illinois-capacitor?region=nac; DESCRIPTION: Aluminum Organic Polymer Capacitors 220uF 50V 20% POLYMER/IC; HEIGHT: 13.5mm; MANUFACTURER_NAME: Cornell Dubilier; MANUFACTURER_PART_NUMBER: 227AVG050MGBJ; MOUSER_PART_NUMBER: 598-227AVG050MGBJ; MOUSER_PRICE-STOCK: https://www.mouser.co.uk/ProductDetail/CDE-Illinois-Capacitor/227AVG050MGBJ?qs=3tP%252BN51vMXcM1n2KkRxEhg%3D%3D
C39 = Tello_Power_PCB:MICROBUILDER_CAP_CERAMIC: Ceramic Capacitors 0402 - 0402 Surface Mount Capacitors 16pF 50V 5% [Digikey: 445-4899-2-ND] 18pF 50V 5% [Digikey: 490-1281-2-ND] 22pF 50V 5% [Digikey: 490-1283-2-ND] 68pF 50V 5% [Digikey: 490-1289-2-ND] 0.1uF 10V 10% [Digikey: 490-1318-2-ND] 1.0uF 6.3V 10% [Digikey: 490-1320-2-ND] 0603 - 0603 Surface Mount Capacitors 16 pF 50V 5% [Digikey: 445-5051-2-ND] 22 pF 50V [Digikey: PCC220ACVTR-ND] 33 pF 50V 5% [Digikey: 490-1415-1-ND] 56pF 50V 5% [Digikey: 490-1421-1-ND] 220pF 50V 5% [Digikey: 445-1285-1-ND] 680 pF 50V 2200 pF 50V 5% C0G [Digikey: 445-1297-1-ND] 5600 pF 100V 5% X7R [Digikey: 478-3711-1-ND] 0.1 µF 25V 10% [Digikey: PCC2277TR-ND] 0.22 µF 16V 10% X7R [Digikey: 445-1318-1-ND] 1.0 µF 25V 10% [Digikey: 445-5146-2-ND] 0603 - RF Specific 3pF 250V +/-0.1pF RF [Digikey: 712-1347-1-ND] 18 pF 250V 5% [Digikey: 478-3505-1-ND or 712-1322-1-ND] 56 pF 250V 5% C0G RF [Digikey: 490-4867-1-ND] 68 pF 250V RF [Digikey: 490-4868-1-ND] 0805 - 0805 Surface Mount Capacitors 220 pF 250V 2% RF Ceramic Capacitor [Digikey: 712-1398-1-ND] 1000 pF 50V 2% NP0 Ceramic Capacitor [Digikey: 478-3760-1-ND] 0.1 µF 25V 10% Ceramic Capacitor [Digikey: PCC1828TR-ND] 1.0 µF 16V 10% Ceramic Capacitor[Digikey: 490-1691-2-ND] 10.0 µF 10V 10% Ceramic Capacitor[Digikey: 709-1228-1-ND] 10.0 uF 16V 10% Ceramic Capacitor [Digikey: 478-5165-2-ND] 47 uF 6.3V 20% Ceramic Capacitor [Digikey: 587-1779-1-ND or 399-5506-1-ND] 1206 - 1206 Surface Mount Capacitors 47uF 10V 20% Ceramic Capacitor [Digikey: 490-5528-1-ND or 399-5508-1-ND or 445-6010-1-ND] 100uF 6.3V -20%, +80% Y5V Ceramic Capacitor (Digikey: 490-4512-1-ND, Mouser: 81-GRM31CF50J107ZE1L)
CON1-CON4 = Tello_Power_PCB:AMASS_XT30: AMASS XT30 connector Store in Japan AMASS XT30 connector <https://szc.jp/ams-xt30>
CON7 = Tello_Power_PCB:AMASS_XT60: AMASS XT60 connector Store in Japan AMASS XT60 connector <https://szc.jp/ams-xt60>
CR1 CR2 = Tello_Power_PCB:STPS1150A_STPS1150A; BUILT_BY: EMA_UL_Team; MANUFACTURER_PART_NUMBER: STPS1150A; SOURCELIBRARY: Update_to_database_2020-11-24; VENDOR: STMicroelectronics
J1 = Tello_Power_PCB:PJ-002A_PJ-002A: 2.0 mm Center Pin, 2.5 A, Right Angle, Through Hole, Dc Power Jack Connector; CUI_PURCHASE_URL: https://www.cuidevices.com/product/interconnect/connectors/dc-power-connectors/jacks/pj-002a?utm_source=snapeda.com&utm_medium=referral&utm_campaign=snapedaBOM; DESCRIPTION: 2.0 x 6.5 mm, 2.5 A, Horizontal, Through Hole, Dc Power Jack Connector; DIGI-KEY_PART_NUMBER: CP-002A-ND; MF: CUI Devices; MP: PJ-002A; PACKAGE: None; PURCHASE-URL: https://pricing.snapeda.com/search/part/PJ-002A/?ref=eda
J2-J9 = Tello_Power_PCB:1719740002_1719740002: 2.54mm Pitch SL Header, Single Row, Right-Angle, LCP, Shrouded, Through Hole, Matte Tin (Sn) Plating, 2 Circuits; DESCRIPTION: Connector Header Through Hole, Right Angle 2 position 0.100 (2.54mm); DIGI-KEY_PART_NUMBER: WM22662-ND; MF: Molex; MP: 1719740002; PACKAGE: None; PURCHASE-URL: https://pricing.snapeda.com/search/part/1719740002/?ref=eda
J10 = Tello_Power_PCB:SM02B-GHS-TB_SM02BGHSTBLFSN; COPYRIGHT: Copyright (C) 2022 Ultra Librarian. All rights reserved.; DIGI-KEY_PART_NUMBER_1: 455-1564-2-ND; DIGI-KEY_PART_NUMBER_2: 455-1564-1-ND; DIGI-KEY_PART_NUMBER_3: 455-1564-6-ND; MANUFACTURER_PART_NUMBER: SM02BGHSTBLFSN; MFR_NAME: JST
JP1 = Tello_Power_PCB:PINHEAD_PINHD-2X6: PIN HEADER
JP2 = Tello_Power_PCB:SPARKFUN-JUMPERS_JUMPER-SMT_2_NC_PASTE: Normally closed solder jumper This jumper has an aperture in the stencil to allow solder paste to bridge the split in the wire so it's normally closed (NC). Wick off the solder to open the connection. Reapply solder to reclose the connection.
L1 = Tello_Power_PCB:12V--LM3150_74437358082; DATASHEETURL: httpkatalog.we%2Donline.depbsdatasheet74437358082.pdf; DCR: 0.045; IDC: 13.0; L: 8.2E6; MANUFACTURER_NAME: Wurth Elektronik; MANUFACTURER_PART_NUMBER: 74437358082; VENDOR: Wurth Elektronik
L2 = Tello_Power_PCB:5V-LM3150MH_XAL5030-222MEB; DCR: 0.01; IDC: 9.2; L: 2.2E6; MANUFACTURER_NAME: Coilcraft; MANUFACTURER_PART_NUMBER: XAL5030222MEB; VENDOR: Coilcraft
L3 = Tello_Power_PCB:XAL4030-332MEB_XAL4030-332MEB: Fixed Inductors XAL4030 High Current 3.3 uH 20 % 6.6 A Source: Datasheet <http://www.mouser.com/ds/2/597/xal4000-270751.pdf>; DESCRIPTION: Fixed Inductors XAL4030 High Current 3.3 uH 20 % 6.6 A; HEIGHT: mm; MANUFACTURER_NAME: COILCRAFT; MANUFACTURER_PART_NUMBER: XAL4030-332MEB; MOUSER_PART_NUMBER: 994-XAL4030-332MEB; MOUSER_PRICE-STOCK: https://www.mouser.com/Search/Refine.aspx?Keyword=994-XAL4030-332MEB
L4 = Tello_Power_PCB:5V-LM3150MH_NPI43C3R9MTRF; DCR: 0.07; IDC: 2.0; L: 3.9E6; MANUFACTURER_NAME: NIC Components; MANUFACTURER_PART_NUMBER: NPI43C3R9MTRF; VENDOR: NIC Components
LED1-LED4 = Tello_Power_PCB:LED_LED: LED OSRAM: - CHIPLED LG R971, LG N971, LY N971, LG Q971, LY Q971, LO R971, LY R971 LH N974, LH R974 LS Q976, LO Q976, LY Q976 LO Q996 - Hyper CHIPLED LW Q18S LB Q993, LB Q99A, LB R99A - SideLED LS A670, LO A670, LY A670, LG A670, LP A670 LB A673, LV A673, LT A673, LW A673 LH A674 LY A675 LS A676, LA A676, LO A676, LY A676, LW A676 LS A679, LY A679, LG A679 - Hyper Micro SIDELED® LS Y876, LA Y876, LO Y876, LY Y876 LT Y87S - SmartLED LW L88C, LW L88S LB L89C, LB L89S, LG L890 LS L89K, LO L89K, LY L89K LS L896, LA L896, LO L896, LY L896 - TOPLED LS T670, LO T670, LY T670, LG T670, LP T670 LSG T670, LSP T670, LSY T670, LOP T670, LYG T670 LG T671, LOG T671, LSG T671 LB T673, LV T673, LT T673, LW T673 LH T674 LS T676, LA T676, LO T676, LY T676, LB T676, LH T676, LSB T676, LW T676 LB T67C, LV T67C, LT T67C, LS T67K, LO T67K, LY T67K, LW E67C LS E67B, LA E67B, LO E67B, LY E67B, LB E67C, LV E67C, LT E67C LW T67C LS T679, LY T679, LG T679 LS T770, LO T770, LY T770, LG T770, LP T770 LB T773, LV T773, LT T773, LW T773 LH T774 LS E675, LA E675, LY E675, LS T675 LS T776, LA T776, LO T776, LY T776, LB T776 LHGB T686 LT T68C, LB T68C - Hyper Mini TOPLED® LB M676 - Mini TOPLED Santana® LG M470 LS M47K, LO M47K, LY M47K Source: http://www.osram.convergy.de LUXEON: - LUMILED® LXK2-PW12-R00, LXK2-PW12-S00, LXK2-PW14-U00, LXK2-PW14-V00 LXK2-PM12-R00, LXK2-PM12-S00, LXK2-PM14-U00 LXK2-PE12-Q00, LXK2-PE12-R00, LXK2-PE12-S00, LXK2-PE14-T00, LXK2-PE14-U00 LXK2-PB12-K00, LXK2-PB12-L00, LXK2-PB12-M00, LXK2-PB14-N00, LXK2-PB14-P00, LXK2-PB14-Q00 LXK2-PR12-L00, LXK2-PR12-M00, LXK2-PR14-Q00, LXK2-PR14-R00 LXK2-PD12-Q00, LXK2-PD12-R00, LXK2-PD12-S00 LXK2-PH12-R00, LXK2-PH12-S00 LXK2-PL12-P00, LXK2-PL12-Q00, LXK2-PL12-R00 Source: www.luxeon.com KINGBRIGHT: KA-3528ASYC Source: www.kingbright.com
M1 = Tello_Power_PCB:12V--LM3150_CSD17579Q5A*?:1; DATASHEETURL: httpwww.ti.comlitdssymlinkCSD17579Q5A.pdf; IDSMAX: 14.0A; MANUFACTURER_NAME: Texas Instruments; MANUFACTURER_PART_NUMBER: CSD17579Q5A; QGTYP: 5.4nC; QUANTITY: 1; RDSONAT10V: 0.0084Ohm; VDSMAX: 30.0V; VENDOR: Texas Instruments
M2 = Tello_Power_PCB:12V--LM3150_CSD18537NQ5A*?:1; DATASHEETURL: httpwww.ti.comlitdssymlinkcsd18537nq5a.pdf; IDSMAX: 50.0; MANUFACTURER_NAME: Texas Instruments; MANUFACTURER_PART_NUMBER: CSD18537NQ5A; QGTYP: 14.0; QUANTITY: 1; RDSON45: 0.014559; VDSMAX: 60.0; VENDOR: Texas Instruments
M3 = Tello_Power_PCB:5V-LM3150MH_CSD17579Q5A; DATASHEETURL: httpwww.ti.comlitdssymlinkCSD17579Q5A.pdf; IDSMAX: 14.0A; MANUFACTURER_NAME: Texas Instruments; MANUFACTURER_PART_NUMBER: CSD17579Q5A; QGTYP: 5.4nC; QUANTITY: 1; RDSONAT10V: 0.0084Ohm; VDSMAX: 30.0V; VENDOR: Texas Instruments
M4 = Tello_Power_PCB:5V-LM3150MH_CSD18537NQ5A; DATASHEETURL: httpwww.ti.comlitdssymlinkcsd18537nq5a.pdf; IDSMAX: 50.0; MANUFACTURER_NAME: Texas Instruments; MANUFACTURER_PART_NUMBER: CSD18537NQ5A; QGTYP: 14.0; QUANTITY: 1; RDSON45: 0.014559; VDSMAX: 60.0; VENDOR: Texas Instruments
Q1 Q2 = Tello_Power_PCB:BSC027N06LS5ATMA1_BSC027N06LS5ATMA1: MOSFET DIFFERENTIATED MOSFETS Source: Datasheet <https://datasheet.datasheetarchive.com/originals/distributors/DKDS-30/596570.pdf>; ARROW_PART_NUMBER: BSC027N06LS5ATMA1; ARROW_PRICE-STOCK: https://www.arrow.com/en/products/bsc027n06ls5atma1/infineon-technologies-ag; DESCRIPTION: MOSFET DIFFERENTIATED MOSFETS; HEIGHT: 1mm; MANUFACTURER_NAME: Infineon; MANUFACTURER_PART_NUMBER: BSC027N06LS5ATMA1; MOUSER_PART_NUMBER: 726-BSC027N06LS5ATMA; MOUSER_PRICE-STOCK: https://www.mouser.co.uk/ProductDetail/Infineon-Technologies/BSC027N06LS5ATMA1?qs=HXFqYaX1Q2z6vEIhZX7Vzw%3D%3D
Q3 Q7-Q9 = Tello_Power_PCB:IXTA96P085T_IXTA96P085T: MOSFET -96 Amps -85V 0.013 Rds Source: Datasheet <http://ixapps.ixys.com/datasheet/ds100025b(ixta-th-tp96p085t).pdf>; ARROW_PART_NUMBER: IXTA96P085T; ARROW_PRICE-STOCK: https://www.arrow.com/en/products/ixta96p085t/ixys; DESCRIPTION: MOSFET -96 Amps -85V 0.013 Rds; HEIGHT: 4.83mm; MANUFACTURER_NAME: LITTELFUSE; MANUFACTURER_PART_NUMBER: IXTA96P085T; MOUSER_PART_NUMBER: 747-IXTA96P085T; MOUSER_PRICE-STOCK: https://www.mouser.co.uk/ProductDetail/IXYS/IXTA96P085T?qs=cvHLLyFtoE0pYb9zzr%252BXGQ%3D%3D
R1 = Tello_Power_PCB:12V--LM3150_CRCW04021R00FKED; MANUFACTURER_NAME: VishayDale; MANUFACTURER_PART_NUMBER: CRCW04021R00FKED; POWER: 0.063; RESISTANCE: 1.0; TOLERANCE: 1.0; VENDOR: VishayDale
R2 = Tello_Power_PCB:12V--LM3150_ERJ-6ENF3323V; MANUFACTURER_NAME: Panasonic; MANUFACTURER_PART_NUMBER: ERJ6ENF3323V; POWER: 0.125; RESISTANCE: 332000.0; TOLERANCE: 1.0; VENDOR: Panasonic
R3 = Tello_Power_PCB:12V--LM3150_ERJ-6ENF1371V; MANUFACTURER_NAME: Panasonic; MANUFACTURER_PART_NUMBER: ERJ6ENF1371V; POWER: 0.125; RESISTANCE: 1370.0; TOLERANCE: 1.0; VENDOR: Panasonic
R4 R17 R18 = Tello_Power_PCB:68XR10KLF_68XR10KLF; COPYRIGHT: Copyright (C) 2022 Ultra Librarian. All rights reserved.; DIGI-KEY_PART_NUMBER_1: 987-1112-ND; MANUFACTURER_PART_NUMBER: 68XR10KLF; MFR_NAME: TT Electronics
R5 R11-R16 R19-R22 R25 R27-R30 R38-R42 = Tello_Power_PCB:RCL_R-US_: RESISTOR, American symbol; SPICEPREFIX: R
R6 = Tello_Power_PCB:5V-LM3150MH_ERJ-3RSFR10V; MANUFACTURER_NAME: Panasonic; MANUFACTURER_PART_NUMBER: ERJ3RSFR10V; POWER: 0.1; RESISTANCE: 0.1; TOLERANCE: 1.0; VENDOR: Panasonic
R7 = Tello_Power_PCB:5V-LM3150MH_ERJ-6ENF5112V; MANUFACTURER_NAME: Panasonic; MANUFACTURER_PART_NUMBER: ERJ6ENF5112V; POWER: 0.125; RESISTANCE: 51100.0; TOLERANCE: 1.0; VENDOR: Panasonic
R8 = Tello_Power_PCB:5V-LM3150MH_ERJ-6ENF1581V; MANUFACTURER_NAME: Panasonic; MANUFACTURER_PART_NUMBER: ERJ6ENF1581V; POWER: 0.125; RESISTANCE: 1580.0; TOLERANCE: 1.0; VENDOR: Panasonic
R9 = Tello_Power_PCB:5V-LM3150MH_CRCW080573K2FKEA; MANUFACTURER_NAME: VishayDale; MANUFACTURER_PART_NUMBER: CRCW080573K2FKEA; POWER: 0.125; RESISTANCE: 73200.0; TOLERANCE: 1.0; VENDOR: VishayDale
R10 = Tello_Power_PCB:5V-LM3150MH_CRCW080510K0FKEA; MANUFACTURER_NAME: VishayDale; MANUFACTURER_PART_NUMBER: CRCW080510K0FKEA; POWER: 0.125; RESISTANCE: 10000.0; TOLERANCE: 1.0; VENDOR: VishayDale
R23 R24 R26 R31-R37 = Tello_Power_PCB:MICROBUILDER_RESISTOR: Resistors 0402 - 0402 Surface Mount Package 22 Ohm 1% 1/16W [Digikey: 311-22.0LRTR-ND] 33 Ohm 5% 1/16W 1.0K 5% 1/16W 1.5K 5% 1/16W 2.0K 1% 1/16W 10.0K 1% 1/16W [Digikey: 311-10.0KLRTR-ND] 10.0K 5% 1/16W [Digikey: RMCF0402JT10K0TR-ND] 12.1K 1% 1/16W [Digikey: 311-22.0LRTR-ND] 100.0K 5% 1/16W 0603 - 0603 Surface Mount Package 0 Ohm 1/10 Watt 1% Resistor 15 Ohm 1/10 Watt 1% Resistor 33 Ohm 1/10 Watt 1% Resistor 49.9 Ohm 1/10 Watt 1% Resistor 100 Ohm 1/10 Watt 1% Resistor 150 Ohm 1/10 Watt 1% Resistor 240 Ohm 1/10 Watt 1% Resistor 390 Ohm 1/10 Watt 1% Resistor 560 Ohm 1/10 Watt 1% Resistor 680 Ohm 1/10 Watt 1% Resistor 750 Ohm 1/10 Watt 1% Resistor 1.0K Ohm 1/10 Watt 1% Resistor 1.5K Ohm 1/10 Watt 1% Resistor 2.0K Ohm 1/10 Watt 1% Resistor 2.2K Ohm 1/10 Watt 1% Resistor 3.3K Ohm 1/10 Watt 1% Resistor 4.7K Ohm 1/10 Watt 1% Resistor 10.0K Ohm 1/10 Watt 1% Resistor 12.0K Ohm 1/10 Watt 1% Resistor 12.1K Ohm 1/10 Watt 1% Resistor 20.0K Ohm 1/10 Watt 1% Resistor 33.0K Ohm 1/10 Watt 1% Resistor 100.0K Ohm 1/10 Watt 1% Resistor 0805 - 0805 Surface Mount Package 0 Ohm 1/8 Watt 1% Resistor 33 Ohm 1/8 Watt 1% Resistor 100 Ohm 1/8 Watt 1% Resistor 150 Ohm 1/8 Watt 1% Resistor 200 Ohm 1/8 Watt 1% Resistor 240 Ohm 1/8 Watt 1% Resistor 330 Ohm 1/8 Watt 1% Resistor 390 Ohm 1/8 Watt 1% Resistor 470 Ohm 1/8 Watt 1% Resistor 1.0K Ohm 1/8 Watt 1% Resistor 1.5K Ohm 1/8 Watt 1% Resistor 2.0K Ohm 1/8 Watt 1% Resistor 4.7K Ohm 1/8 Watt 1% Resistor 5.1K Ohm 1/8 Watt 1% Resistor 5.6K Ohm 1/8 Watt 1% Resistor 10.0K Ohm 1/8 Watt 1% Resistor 22.0K Ohm 1/8 Watt 1% Resistor 33.0K Ohm 1/8 Watt 1% Resistor 100K Ohm 1/8 Watt 1% Resistor 1206 - 1206 Surface Mount Package 2012 - 2010 Surface Mount Package 0.11 Ohm 1/2 Watt 1% Resistor - Digikey: RHM.11UCT-ND
U1 U2 = Tello_Power_PCB:5V-LM3150MH_LM3150MH/NOPB; DATASHEETURL: httpwww.ti.comproductlm3150; FREQUENCY: 1000000.0; IMAX: 12.0; MANUFACTURER_NAME: Texas Instruments; MANUFACTURER_PART_NUMBER: LM3150MHNOPB; MKTG_PACKAGE: NA; NSID: LM3150MHNOPB; PACKAGE: NA; VENDOR: Texas Instruments
U3 U8 = Tello_Power_PCB:LTC4357_LTC4357CMS8TRPBF; BUILT_BY: EMA_UL_Team; MANUFACTURER_PART_NUMBER: ltc4357cms8#trpbf; SOURCELIBRARY: LinearTech_2016_03_08; VENDOR: Linear Technology
U4 = Tello_Power_PCB:MICROBUILDER_ADC_ADS1015: ADS1015 - 12-bit 4-Channel I2C ADC with Internal PGA VDD: 2.0-5.5V Sampling Rate: 3.3ksps Gain Settings: 2/3, 1, 2, 4, 8, 16 I2C Address: ADDR low = 1001000x, ADDR high = 1001001x Internal Comparator The ADS1015 includes an internal comparator that can be set to output a high-level on ALERT when the conversion results exceeeds a pre-defined upper level, and will deassert itself when the level falls below a pre-defined lower threshold level. It can also be set to windowed mode where the ALERT pin will be asserted if the data exceeds the upper threshold or falls below the lower threshold.
U5-U7 U12 = Tello_Power_PCB:DMN67D8LW-13_DMN67D8LW-13; COPYRIGHT: Copyright (C) 2022 Ultra Librarian. All rights reserved.; DIGI-KEY_PART_NUMBER_1: DMN67D8LW-13DITR-ND; DIGI-KEY_PART_NUMBER_2: DMN67D8LW-13DICT-ND; DIGI-KEY_PART_NUMBER_3: DMN67D8LW-13DIDKR-ND; MANUFACTURER_PART_NUMBER: DMN67D8LW-13; MFR_NAME: Diodes Inc
U9-U11 U14 = Tello_Power_PCB:TLV6713DDC_TLV6713DDCT; COPYRIGHT: Copyright (C) 2022 Ultra Librarian. All rights reserved.; DIGI-KEY_PART_NUMBER_1: 296-49090-1-ND; DIGI-KEY_PART_NUMBER_2: 296-49090-2-ND; DIGI-KEY_PART_NUMBER_3: 296-49090-6-ND; MANUFACTURER_PART_NUMBER: TLV6713DDCT; MFR_NAME: Texas Instruments; REFDES: RefDes; TYPE: TYPE
U13 = Tello_Power_PCB:MCP1792T-5002H_MCP1792T-5002H/CB; COPYRIGHT: Copyright (C) 2022 Ultra Librarian. All rights reserved.; DIGI-KEY_PART_NUMBER_1: MCP1792T-5002H/CBTR-ND; DIGI-KEY_PART_NUMBER_2: MCP1792T-5002H/CBCT-ND; DIGI-KEY_PART_NUMBER_3: MCP1792T-5002H/CBDKR-ND; MANUFACTURER_PART_NUMBER: MCP1792T-5002H/CB; MFR_NAME: Microchip